# Altium schematic sheet [04] - PROCESSOR 1 of 3, JTAG HEADER.SchDoc
size A2; DocumentNumber: 4; SheetNumber: 4; SheetTotal: 13; NameAuthor: Angle Vu
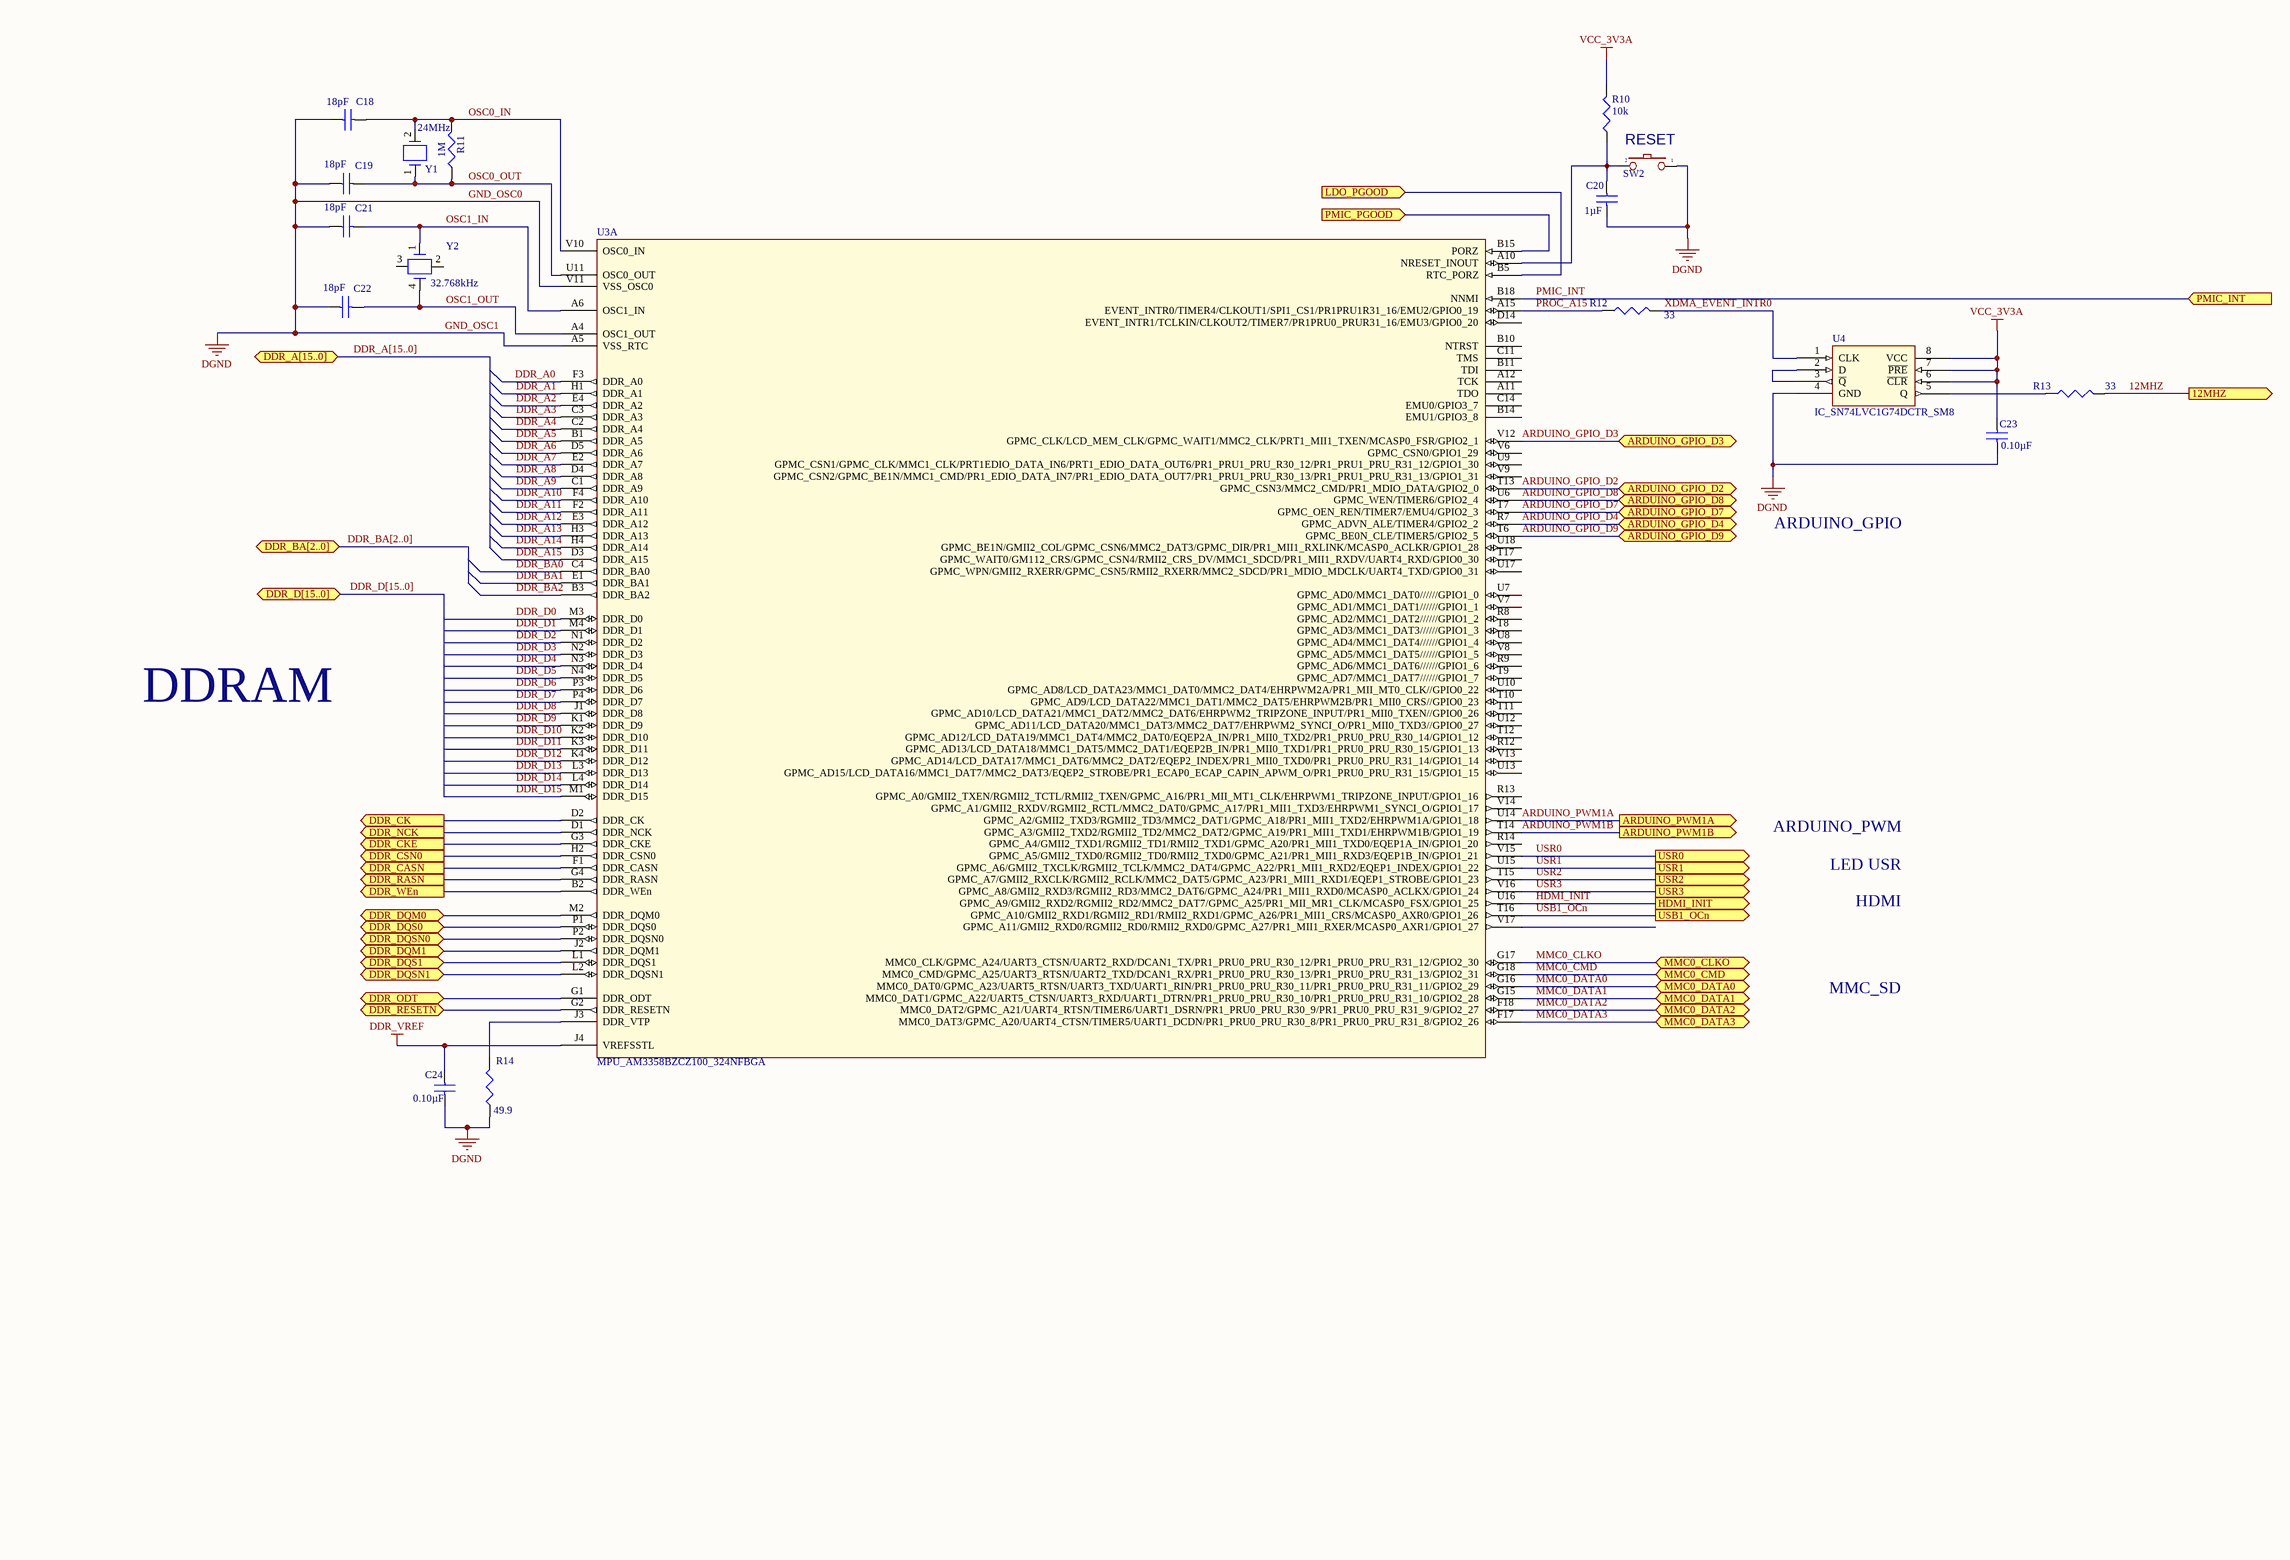
[diagram p0: [04] - PROCESSOR 1 of 3, JTAG HEADER.SchDoc]

## Parts
C18  Capacitance: 18pF  (hidden comment: C_CER_18pF_50V_C0G_0402_5%)
C19  Capacitance: 18pF  (hidden comment: C_CER_18pF_50V_C0G_0402_5%)
C20  Capacitance: 1µF  (hidden comment: C_CER_1uF_6.3V_X5R_0402_10%)
C21  Capacitance: 18pF  (hidden comment: C_CER_18pF_50V_C0G_0402_5%)
C22  Capacitance: 18pF  (hidden comment: C_CER_18pF_50V_C0G_0402_5%)
C23  Capacitance: 0.10µF  (hidden comment: C_CER_0.1uF_6.3V_X5R_0402_10%)
C24  Capacitance: 0.10µF  (hidden comment: C_CER_0.1uF_6.3V_X5R_0402_10%)
R10  Resistance (Ohms): 10k  (hidden comment: R_10K_1/16W_0402_1%)
R11  Resistance (Ohms): 1M  (hidden comment: R_1M_1/16W_0402_1%)
R12  Resistance (Ohms): 33  (hidden comment: R_33_1/16W_0402_5%)
R13  Resistance (Ohms): 33  (hidden comment: R_33_1/16W_0402_5%)
R14  Resistance (Ohms): 49.9  (hidden comment: R_49.9_1/16W_0402_1%)
SW2  SW2_DPST_SURFACE_5MM  [SW2-SMD]  (value not drawn)
U3  MPU_AM3358BZCZ100_324NFBGA  (part A of 3)
U4  IC_SN74LVC1G74DCTR_SM8
Y1  Frequency: 24MHz  (hidden comment: CRYTAL_24Mhz_7A-24.000MAAJ-T)
Y2  Frequency: 32.768kHz  (hidden comment: CRYSTAL_32.7680KhZ_CM200C32768AZFT)

## Ports
12MHZ (out), ARDUINO_GPIO_D2 (bidir), ARDUINO_GPIO_D3 (bidir), ARDUINO_GPIO_D4 (bidir), ARDUINO_GPIO_D7 (bidir), ARDUINO_GPIO_D8 (bidir), ARDUINO_GPIO_D9 (bidir), ARDUINO_PWM1A (out), ARDUINO_PWM1B (out), DDR_A[15..0] (bidir), DDR_BA[2..0] (bidir), DDR_CASN (out), DDR_CK (out), DDR_CKE (out), DDR_CSN0 (out), DDR_D[15..0] (bidir), DDR_DQM0 (bidir), DDR_DQM1 (bidir), DDR_DQS0 (bidir), DDR_DQS1 (bidir), DDR_DQSN0 (bidir), DDR_DQSN1 (bidir), DDR_NCK (out), DDR_ODT (bidir), DDR_RASN (out), DDR_RESETN (bidir), DDR_WEn (out), HDMI_INIT (out), LDO_PGOOD (in), MMC0_CLKO (bidir), MMC0_CMD (bidir), MMC0_DATA0 (bidir), MMC0_DATA1 (bidir), MMC0_DATA2 (bidir), MMC0_DATA3 (bidir), PMIC_INT (in), PMIC_PGOOD (in), USB1_OCn (out), USR0 (out), USR1 (out), USR2 (out), USR3 (out)

## Nets
DDR_VREF: C24.1 U3.J4(VREFSSTL)
GND_OSC0: C18.1 C19.1 C20.2 C21.1 C22.1 C23.2 C24.2 R14.1 SW2.1 U3.A5(VSS_RTC) U3.V11(VSS_OSC0) U4.4(GND)  [also labelled DGND, GND_OSC1]
VCC_3V3A: C23.1 R10.2 U4.6(~{CLR}) U4.7(~{PRE}) U4.8(VCC)
12MHZ: R13.2 ; port 12MHZ
ARDUINO_GPIO_D2: U3.T13(GPMC_CSN3/MMC2_CMD/PR1_MDIO_DATA/GPIO2_0) ; port ARDUINO_GPIO_D2
ARDUINO_GPIO_D3: U3.V12(GPMC_CLK/LCD_MEM_CLK/GPMC_WAIT1/MMC2_CLK/PRT1_MII1_TXEN/MCASP0_FSR/GPIO2_1) ; port ARDUINO_GPIO_D3
ARDUINO_GPIO_D4: U3.R7(GPMC_ADVN_ALE/TIMER4/GPIO2_2) ; port ARDUINO_GPIO_D4
ARDUINO_GPIO_D7: U3.T7(GPMC_OEN_REN/TIMER7/EMU4/GPIO2_3) ; port ARDUINO_GPIO_D7
ARDUINO_GPIO_D8: U3.U6(GPMC_WEN/TIMER6/GPIO2_4) ; port ARDUINO_GPIO_D8
ARDUINO_GPIO_D9: U3.T6(GPMC_BE0N_CLE/TIMER5/GPIO2_5) ; port ARDUINO_GPIO_D9
ARDUINO_PWM1A: U3.U14(GPMC_A2/GMII2_TXD3/RGMII2_TD3/MMC2_DAT1/GPMC_A18/PR1_MII1_TXD2/EHRPWM1A/GPIO1_18) ; port ARDUINO_PWM1A
ARDUINO_PWM1B: U3.T14(GPMC_A3/GMII2_TXD2/RGMII2_TD2/MMC2_DAT2/GPMC_A19/PR1_MII1_TXD1/EHRPWM1B/GPIO1_19) ; port ARDUINO_PWM1B
DDR_A0: U3.F3(DDR_A0)
DDR_A1: U3.H1(DDR_A1)
DDR_A2: U3.E4(DDR_A2)
DDR_A3: U3.C3(DDR_A3)
DDR_A4: U3.C2(DDR_A4)
DDR_A5: U3.B1(DDR_A5)
DDR_A6: U3.D5(DDR_A6)
DDR_A7: U3.E2(DDR_A7)
DDR_A8: U3.D4(DDR_A8)
DDR_A9: U3.C1(DDR_A9)
DDR_A10: U3.F4(DDR_A10)
DDR_A11: U3.F2(DDR_A11)
DDR_A12: U3.E3(DDR_A12)
DDR_A13: U3.H3(DDR_A13)
DDR_A14: U3.H4(DDR_A14)
DDR_A15: U3.D3(DDR_A15)
DDR_BA0: U3.C4(DDR_BA0)
DDR_BA1: U3.E1(DDR_BA1)
DDR_BA2: U3.B3(DDR_BA2)
DDR_CASN: U3.F1(DDR_CASN) ; port DDR_CASN
DDR_CK: U3.D2(DDR_CK) ; port DDR_CK
DDR_CKE: U3.G3(DDR_CKE) ; port DDR_CKE
DDR_CSN0: U3.H2(DDR_CSN0) ; port DDR_CSN0
DDR_D0: U3.M3(DDR_D0)
DDR_D1: U3.M4(DDR_D1)
DDR_D2: U3.N1(DDR_D2)
DDR_D3: U3.N2(DDR_D3)
DDR_D4: U3.N3(DDR_D4)
DDR_D5: U3.N4(DDR_D5)
DDR_D6: U3.P3(DDR_D6)
DDR_D7: U3.P4(DDR_D7)
DDR_D8: U3.J1(DDR_D8)
DDR_D9: U3.K1(DDR_D9)
DDR_D10: U3.K2(DDR_D10)
DDR_D11: U3.K3(DDR_D11)
DDR_D12: U3.K4(DDR_D12)
DDR_D13: U3.L3(DDR_D13)
DDR_D14: U3.L4(DDR_D14)
DDR_D15: U3.M1(DDR_D15)
DDR_DQM0: U3.M2(DDR_DQM0) ; port DDR_DQM0
DDR_DQM1: U3.J2(DDR_DQM1) ; port DDR_DQM1
DDR_DQS0: U3.P1(DDR_DQS0) ; port DDR_DQS0
DDR_DQS1: U3.L1(DDR_DQS1) ; port DDR_DQS1
DDR_DQSN0: U3.P2(DDR_DQSN0) ; port DDR_DQSN0
DDR_DQSN1: U3.L2(DDR_DQSN1) ; port DDR_DQSN1
DDR_NCK: U3.D1(DDR_NCK) ; port DDR_NCK
DDR_ODT: U3.G1(DDR_ODT) ; port DDR_ODT
DDR_RASN: U3.G4(DDR_RASN) ; port DDR_RASN
DDR_RESETN: U3.G2(DDR_RESETN) ; port DDR_RESETN
DDR_WEn: U3.B2(DDR_WEn) ; port DDR_WEn
HDMI_INIT: U3.U16(GPMC_A9/GMII2_RXD2/RGMII2_RD2/MMC2_DAT7/GPMC_A25/PR1_MII_MR1_CLK/MCASP0_FSX/GPIO1_25) ; port HDMI_INIT
LDO_PGOOD: U3.B5(RTC_PORZ) ; port LDO_PGOOD
MMC0_CLKO: U3.G17(MMC0_CLK/GPMC_A24/UART3_CTSN/UART2_RXD/DCAN1_TX/PR1_PRU0_PRU_R30_12/PR1_PRU0_PRU_R31_12/GPIO2_30) ; port MMC0_CLKO
MMC0_CMD: U3.G18(MMC0_CMD/GPMC_A25/UART3_RTSN/UART2_TXD/DCAN1_RX/PR1_PRU0_PRU_R30_13/PR1_PRU0_PRU_R31_13/GPIO2_31) ; port MMC0_CMD
MMC0_DATA0: U3.G16(MMC0_DAT0/GPMC_A23/UART5_RTSN/UART3_TXD/UART1_RIN/PR1_PRU0_PRU_R30_11/PR1_PRU0_PRU_R31_11/GPIO2_29) ; port MMC0_DATA0
MMC0_DATA1: U3.G15(MMC0_DAT1/GPMC_A22/UART5_CTSN/UART3_RXD/UART1_DTRN/PR1_PRU0_PRU_R30_10/PR1_PRU0_PRU_R31_10/GPIO2_28) ; port MMC0_DATA1
MMC0_DATA2: U3.F18(MMC0_DAT2/GPMC_A21/UART4_RTSN/TIMER6/UART1_DSRN/PR1_PRU0_PRU_R30_9/PR1_PRU0_PRU_R31_9/GPIO2_27) ; port MMC0_DATA2
MMC0_DATA3: U3.F17(MMC0_DAT3/GPMC_A20/UART4_CTSN/TIMER5/UART1_DCDN/PR1_PRU0_PRU_R30_8/PR1_PRU0_PRU_R31_8/GPIO2_26) ; port MMC0_DATA3
OSC0_IN: C18.2 R11.2 U3.V10(OSC0_IN) Y1.2
OSC0_OUT: C19.2 R11.1 U3.U11(OSC0_OUT) Y1.1
OSC1_IN: C21.2 U3.A6(OSC1_IN) Y2.1
OSC1_OUT: C22.2 U3.A4(OSC1_OUT) Y2.4
PMIC_INT: U3.B18(NNMI) ; port PMIC_INT
PMIC_PGOOD: U3.B15(PORZ) ; port PMIC_PGOOD
PROC_A15: R12.1 U3.A15(EVENT_INTR0/TIMER4/CLKOUT1/SPI1_CS1/PR1PRU1R31_16/EMU2/GPIO0_19)
USB1_OCn: U3.T16(GPMC_A10/GMII2_RXD1/RGMII2_RD1/RMII2_RXD1/GPMC_A26/PR1_MII1_CRS/MCASP0_AXR0/GPIO1_26) ; port USB1_OCn
USR0: U3.V15(GPMC_A5/GMII2_TXD0/RGMII2_TD0/RMII2_TXD0/GPMC_A21/PR1_MII1_RXD3/EQEP1B_IN/GPIO1_21) ; port USR0
USR1: U3.U15(GPMC_A6/GMII2_TXCLK/RGMII2_TCLK/MMC2_DAT4/GPMC_A22/PR1_MII1_RXD2/EQEP1_INDEX/GPIO1_22) ; port USR1
USR2: U3.T15(GPMC_A7/GMII2_RXCLK/RGMII2_RCLK/MMC2_DAT5/GPMC_A23/PR1_MII1_RXD1/EQEP1_STROBE/GPIO1_23) ; port USR2
USR3: U3.V16(GPMC_A8/GMII2_RXD3/RGMII2_RD3/MMC2_DAT6/GPMC_A24/PR1_MII1_RXD0/MCASP0_ACLKX/GPIO1_24) ; port USR3
XDMA_EVENT_INTR0: R12.2 U4.1(CLK)
NetC20_1: C20.1 R10.1 SW2.2 U3.A10(NRESET_INOUT)
NetR13_1: R13.1 U4.5(Q)
NetR14_2: R14.2 U3.J3(DDR_VTP)
NetU4_2: U4.2(D) U4.3(~{Q})

Not connected (* = marked no-connect by the designer): U3 A11(TDO) A12(TCK) B10(NTRST) B11(TDI) B14(EMU1/GPIO3_8) C11(TMS) C14(EMU0/GPIO3_7) D14(EVENT_INTR1/TCLKIN/CLKOUT2/TIMER7/PR1PRU0_PRUR31_16/EMU3/GPIO0_20) R8(GPMC_AD2/MMC1_DAT2//////GPIO1_2) R9(GPMC_AD6/MMC1_DAT6//////GPIO1_6) R12(GPMC_AD13/LCD_DATA18/MMC1_DAT5/MMC2_DAT1/EQEP2B_IN/PR1_MII0_TXD1/PR1_PRU0_PRU_R30_15/GPIO1_13) R13(GPMC_A0/GMII2_TXEN/RGMII2_TCTL/RMII2_TXEN/GPMC_A16/PR1_MII_MT1_CLK/EHRPWM1_TRIPZONE_INPUT/GPIO1_16) R14(GPMC_A4/GMII2_TXD1/RGMII2_TD1/RMII2_TXD1/GPMC_A20/PR1_MII1_TXD0/EQEP1A_IN/GPIO1_20) T8(GPMC_AD3/MMC1_DAT3//////GPIO1_3) T9(GPMC_AD7/MMC1_DAT7//////GPIO1_7) T10(GPMC_AD9/LCD_DATA22/MMC1_DAT1/MMC2_DAT5/EHRPWM2B/PR1_MII0_CRS//GPIO0_23) T11(GPMC_AD10/LCD_DATA21/MMC1_DAT2/MMC2_DAT6/EHRPWM2_TRIPZONE_INPUT/PR1_MII0_TXEN//GPIO0_26) T12(GPMC_AD12/LCD_DATA19/MMC1_DAT4/MMC2_DAT0/EQEP2A_IN/PR1_MII0_TXD2/PR1_PRU0_PRU_R30_14/GPIO1_12) T17(GPMC_WAIT0/GM112_CRS/GPMC_CSN4/RMII2_CRS_DV/MMC1_SDCD/PR1_MII1_RXDV/UART4_RXD/GPIO0_30) U7(GPMC_AD0/MMC1_DAT0//////GPIO1_0) U8(GPMC_AD4/MMC1_DAT4//////GPIO1_4) U9(GPMC_CSN1/GPMC_CLK/MMC1_CLK/PRT1EDIO_DATA_IN6/PRT1_EDIO_DATA_OUT6/PR1_PRU1_PRU_R30_12/PR1_PRU1_PRU_R31_12/GPIO1_30) U10(GPMC_AD8/LCD_DATA23/MMC1_DAT0/MMC2_DAT4/EHRPWM2A/PR1_MII_MT0_CLK//GPIO0_22) U12(GPMC_AD11/LCD_DATA20/MMC1_DAT3/MMC2_DAT7/EHRPWM2_SYNCI_O/PR1_MII0_TXD3//GPIO0_27) U13(GPMC_AD15/LCD_DATA16/MMC1_DAT7/MMC2_DAT3/EQEP2_STROBE/PR1_ECAP0_ECAP_CAPIN_APWM_O/PR1_PRU0_PRU_R31_15/GPIO1_15) U17(GPMC_WPN/GMII2_RXERR/GPMC_CSN5/RMII2_RXERR/MMC2_SDCD/PR1_MDIO_MDCLK/UART4_TXD/GPIO0_31) U18(GPMC_BE1N/GMII2_COL/GPMC_CSN6/MMC2_DAT3/GPMC_DIR/PR1_MII1_RXLINK/MCASP0_ACLKR/GPIO1_28) V6(GPMC_CSN0/GPIO1_29) V7(GPMC_AD1/MMC1_DAT1//////GPIO1_1) V8(GPMC_AD5/MMC1_DAT5//////GPIO1_5) V9(GPMC_CSN2/GPMC_BE1N/MMC1_CMD/PR1_EDIO_DATA_IN7/PR1_EDIO_DATA_OUT7/PR1_PRU1_PRU_R30_13/PR1_PRU1_PRU_R31_13/GPIO1_31) V13(GPMC_AD14/LCD_DATA17/MMC1_DAT6/MMC2_DAT2/EQEP2_INDEX/PR1_MII0_TXD0/PR1_PRU0_PRU_R31_14/GPIO1_14) V14(GPMC_A1/GMII2_RXDV/RGMII2_RCTL/MMC2_DAT0/GPMC_A17/PR1_MII1_TXD3/EHRPWM1_SYNCI_O/GPIO1_17) V17(GPMC_A11/GMII2_RXD0/RGMII2_RD0/RMII2_RXD0/GPMC_A27/PR1_MII1_RXER/MCASP0_AXR1/GPIO1_27); Y2 2 3

## Buses and harness runs
bus DDR_A[15..0] = port DDR_A[15..0]
bus DDR_BA[2..0] = port DDR_BA[2..0]
bus DDR_D[15..0] = port DDR_D[15..0]

## Notes on the sheet
- RESET
- ARDUINO_GPIO
- DDRAM
- ARDUINO_PWM
- LED USR
- HDMI
- MMC_SD
- CLOCKS (CPU & PCIE)
- Designed By
- Checked By
- Page Name:
- Size:
- A2
- Company:
- Address:
- Sheet:
- /

## Library data of the parts
C18 C19 C21 C22 = C_CER_18pF_50V_C0G_0402_5%: CAP CER 18PF 50V NP0 0402; Manufacturer: Murata Electronics North America; Manufacturer Part Number: GRM1555C1H180JZ01D; Tolerance: ±5%; Temperature Coefficient: C0G, NP0; Supplier 1: Digi-Key; RoHS: RoHS Compliant; Category: Capacitors; Stock 1: 0; Pricing 1: 10000=0 (USD); Packaging: Tape & Reel (TR); Part Status: Obsolete; Voltage - Rated: 50V; Operating Temperature: -55°C ~ 125°C; Features: -; Ratings: -; Applications: General Purpose; Failure Rate: *; Mounting Type: Surface Mount, MLCC; Package / Case: 0402 (1005 Metric); Size / Dimension: 0.039" L x 0.020" W (1.00mm x 0.50mm); Height - Seated (Max): -; Thickness (Max): 0.022" (0.55mm); Lead Spacing: -; Lead Style: -; ComponentLink1URL: http://media.digikey.com/pdf/Data%20Sheets/Murata%20PDFs/Chip%20Monolithic%20Ceramic%20Caps.pdf; ComponentLink1Description: http://media.digikey.com/pdf/Data%20Sheets/Murata%20PDFs/Chip%20Monolithic%20Ceramic%20Caps.pdf; Supplier Part Number 1: 490-1281-2-ND
C20 = C_CER_1uF_6.3V_X5R_0402_10%: CAP CER 1UF 6.3V X5R 0402; Manufacturer: Murata Electronics North America; Manufacturer Part Number: GRM155R60J105KE19D; Tolerance: ±10%; Supplier 1: Digi-Key; RoHS: RoHS Compliant; Category: Capacitors; Stock 1: 3360000; Pricing 1: 10000=0.00365, 20000=0.00348, 30000=0.00331, 50000=0.00296, 100000=0.00239 (USD); Packaging: Tape & Reel (TR); Part Status: Active; Voltage - Rated: 6.3V; Temperature Coefficient: X5R; Operating Temperature: -55°C ~ 85°C; Features: -; Ratings: -; Applications: General Purpose; Failure Rate: *; Mounting Type: Surface Mount, MLCC; Package / Case: 0402 (1005 Metric); Size / Dimension: 0.039" L x 0.020" W (1.00mm x 0.50mm); Height - Seated (Max): -; Thickness (Max): 0.022" (0.55mm); Lead Spacing: -; Lead Style: -; ComponentLink1URL: http://www.murata.com/~/media/webrenewal/support/library/catalog/products/capacitor/mlcc/c02e.pdf; ComponentLink1Description: http://www.murata.com/~/media/webrenewal/support/library/catalog/products/capacitor/mlcc/c02e.pdf; Supplier Part Number 1: 490-1320-2-ND
C23 C24 = C_CER_0.1uF_6.3V_X5R_0402_10%: CAP CER 0.1UF 6.3V X5R 0402; Manufacturer: Murata Electronics North America; Manufacturer Part Number: GRM155R60J104KA01D; Tolerance: ±10%; Supplier 1: Digi-Key; RoHS: RoHS Compliant; Category: Capacitors; Stock 1: 370000; Pricing 1: 10000=0.0021, 20000=0.002, 30000=0.0019, 50000=0.0017, 100000=0.00138 (USD); Packaging: Tape & Reel (TR); Part Status: Active; Voltage - Rated: 6.3V; Temperature Coefficient: X5R; Operating Temperature: -55°C ~ 85°C; Features: -; Ratings: -; Applications: General Purpose; Failure Rate: *; Mounting Type: Surface Mount, MLCC; Package / Case: 0402 (1005 Metric); Size / Dimension: 0.039" L x 0.020" W (1.00mm x 0.50mm); Height - Seated (Max): -; Thickness (Max): 0.022" (0.55mm); Lead Spacing: -; Lead Style: -; ComponentLink1URL: http://www.murata.com/~/media/webrenewal/support/library/catalog/products/capacitor/mlcc/c02e.pdf; ComponentLink1Description: http://www.murata.com/~/media/webrenewal/support/library/catalog/products/capacitor/mlcc/c02e.pdf; Supplier Part Number 1: 490-6287-2-ND
R10 = R_10K_1/16W_0402_1%: RES SMD 10K OHM 1% 1/16W 0402; Manufacturer: Yageo; Manufacturer Part Number: RC0402FR-0710KL; Power (Watts): 0.063W, 1/16W; Temperature Coefficient: ±100ppm/°C; Supplier 1: Digi-Key; RoHS: RoHS Compliant; Category: Resistors; Stock 1: 13060454; Pricing 1: 1=0.1, 10=0.013, 25=0.0096, 100=0.0054, 250=0.00412, 500=0.00328, 1000=0.00242, 2500=0.0021, 5000=0.00173 (USD); Packaging: Cut Tape (CT); Part Status: Active; Tolerance: ±1%; Composition: Thick Film; Features: Moisture Resistant; Operating Temperature: -55°C ~ 155°C; Package / Case: 0402 (1005 Metric); Supplier Device Package: 0402; Size / Dimension: 0.039" L x 0.020" W (1.00mm x 0.50mm); Height: 0.016" (0.40mm); Number of Terminations: 2; Failure Rate: -; ComponentLink1URL: http://www.yageo.com/documents/recent/PYu-RC_Group_51_RoHS_L_04.pdf; ComponentLink1Description: http://www.yageo.com/documents/recent/PYu-RC_Group_51_RoHS_L_04.pdf; Supplier Part Number 1: 311-10.0KLRCT-ND
R11 = R_1M_1/16W_0402_1%: RES SMD 1M OHM 1% 1/16W 0402; Manufacturer: Vishay Dale; Manufacturer Part Number: CRCW04021M00FKED; Power (Watts): 0.063W, 1/16W; Temperature Coefficient: ±100ppm/°C; Supplier 1: Digi-Key; RoHS: RoHS Compliant; Category: Resistors; Stock 1: 620000; Pricing 1: 10000=0.0033, 30000=0.0029, 50000=0.00266, 100000=0.00261 (USD); Packaging: Tape & Reel (TR); Part Status: Active; Tolerance: ±1%; Composition: Thick Film; Features: Automotive AEC-Q200; Operating Temperature: -55°C ~ 155°C; Package / Case: 0402 (1005 Metric); Supplier Device Package: 0402; Size / Dimension: 0.039" L x 0.020" W (1.00mm x 0.50mm); Height: 0.016" (0.40mm); Number of Terminations: 2; Failure Rate: -; ComponentLink1URL: http://www.vishay.com/docs/20035/dcrcwe3.pdf; ComponentLink1Description: http://www.vishay.com/docs/20035/dcrcwe3.pdf; Supplier Part Number 1: 541-1.00MLTR-ND
R12 R13 = R_33_1/16W_0402_5%: RES SMD 33 OHM 5% 1/16W 0402; Manufacturer: Yageo; Manufacturer Part Number: RC0402JR-0733RL; Power (Watts): 0.063W, 1/16W; Temperature Coefficient: ±100ppm/°C; Supplier 1: Digi-Key; RoHS: RoHS Compliant; Category: Resistors; Stock 1: 1941028; Pricing 1: 1=0.1, 10=0.012, 25=0.0084, 100=0.0047, 250=0.0036, 500=0.0029, 1000=0.00213, 2500=0.00185, 5000=0.00153 (USD); Packaging: Cut Tape (CT); Part Status: Active; Tolerance: ±5%; Composition: Thick Film; Features: Moisture Resistant; Operating Temperature: -55°C ~ 155°C; Package / Case: 0402 (1005 Metric); Supplier Device Package: 0402; Size / Dimension: 0.039" L x 0.020" W (1.00mm x 0.50mm); Height: 0.016" (0.40mm); Number of Terminations: 2; Failure Rate: -; ComponentLink1URL: http://www.yageo.com/documents/recent/PYu-RC_Group_51_RoHS_L_04.pdf; ComponentLink1Description: http://www.yageo.com/documents/recent/PYu-RC_Group_51_RoHS_L_04.pdf; Supplier Part Number 1: 311-33JRCT-ND
R14 = R_49.9_1/16W_0402_1%: RES SMD 49.9 OHM 1% 1/16W 0402; Manufacturer: Yageo; Manufacturer Part Number: RC0402FR-0749R9L; Power (Watts): 0.063W, 1/16W; Temperature Coefficient: ±100ppm/°C; Supplier 1: Digi-Key; RoHS: RoHS Compliant; Category: Resistors; Stock 1: 3649790; Pricing 1: 1=0.1, 10=0.013, 25=0.0096, 100=0.0054, 250=0.00412, 500=0.00328, 1000=0.00242, 2500=0.0021, 5000=0.00173 (USD); Packaging: Cut Tape (CT); Part Status: Active; Tolerance: ±1%; Composition: Thick Film; Features: Moisture Resistant; Operating Temperature: -55°C ~ 155°C; Package / Case: 0402 (1005 Metric); Supplier Device Package: 0402; Size / Dimension: 0.039" L x 0.020" W (1.00mm x 0.50mm); Height: 0.016" (0.40mm); Number of Terminations: 2; Failure Rate: -; ComponentLink1URL: http://www.yageo.com/documents/recent/PYu-RC_Group_51_RoHS_L_04.pdf; ComponentLink1Description: http://www.yageo.com/documents/recent/PYu-RC_Group_51_RoHS_L_04.pdf; Supplier Part Number 1: 311-49.9LRCT-ND
SW2 = SW2_DPST_SURFACE_5MM: SWITCH TACTILE SPST-NO 0.05A 12V; Manufacturer: Wurth Electronics Inc; Manufacturer Part Number: 434121050836; Switch Function: Off-Mom; Contact Rating @ Voltage: 0.05A @ 12VDC; Actuator Type: Rectangular Button; Actuator Height off PCB, from Pins: 5.00mm; Actuator Orientation: Top Actuated; Outline: 6.00mm x 3.50mm; Illumination: Non-Illuminated; Operating Force: 360gf; Actuator Material: Liquid Crystal Polymer (LCP); Switch Travel: 0.25mm; Mechanical Life: 50,000 Cycles; Supplier 1: Digi-Key; RoHS: RoHS Compliant; Category: Switches; Stock 1: 0; Pricing 1: 1500=0.27 (USD); Packaging: Tape & Reel (TR); Part Status: Active; Circuit: SPST-NO; Mounting Type: Surface Mount; Termination Style: SMD (SMT) Tab; Illumination Voltage (Nominal): -; Illumination Type, Color: -; Ingress Protection: -; Features: -; Operating Temperature: -40°C ~ 85°C; ComponentLink1URL: http://katalog.we-online.de/em/datasheet/434121050836.pdf; ComponentLink1Description: http://katalog.we-online.de/em/datasheet/434121050836.pdf; Supplier Part Number 1: 732-7049-2-ND
U3 = MPU_AM3358BZCZ100_324NFBGA: IC MPU SITARA 1.0GHZ 324NFBGA; Manufacturer: Texas Instruments; Core Processor: ARM® Cortex®-A8; Number of Cores/Bus Width: 1 Core, 32-Bit; Co-Processors/DSP: Multimedia; NEON™ SIMD; RAM Controllers: LPDDR, DDR2, DDR3, DDR3L; Graphics Acceleration: Yes; Display & Interface Controllers: LCD, Touchscreen; Ethernet: 10/100/1000 Mbps (2); USB: USB 2.0 + PHY (2); Voltage - I/O: 1.8V, 3.3V; Security Features: Cryptography, Random Number Generator; Additional Interfaces: CAN, I²C, McASP, McSPI, MMC/SD/SDIO, UART; Supplier 1: Digi-Key; Manufacturer Part Number: AM3358BZCZ100; RoHS: RoHS Compliant; Category: Integrated Circuits (ICs); Stock 1: 6211; Pricing 1: 1=19.56, 10=17.978, 100=15.1835, 500=13.50676, 1000=12.38895, 2500=11.9232, 5000=11.64375 (USD); Packaging: Tube; Part Status: Active; Speed: 1.0GHz; SATA: -; Operating Temperature: 0°C ~ 90°C (TJ); Package / Case: 324-LFBGA; Supplier Device Package: 324-NFBGA(15x15); ComponentLink1URL: http://www.ti.com/lit/ds/symlink/am3352.pdf; ComponentLink1Description: http://www.ti.com/lit/ds/symlink/am3352.pdf; Supplier Part Number 1: 296-35869-5-ND
U4 = IC_SN74LVC1G74DCTR_SM8: IC D-TYPE POS TRG SNGL SM8; Manufacturer: Texas Instruments; Function: Set(Preset) and Reset; Output Type: Differential; Number of Elements: 1; Frequency - Clock: 200MHz; Max Propagation Delay @ V, Max CL: 6.4ns @ 5V, 50pF; Trigger Type: Positive Edge; Current - Output High, Low: 32mA, 32mA; Voltage - Supply: 1.65 V ~ 5.5 V; Current - Quiescent: 10µA; Input Capacitance: 5pF; Supplier 1: Digi-Key; Manufacturer Part Number: SN74LVC1G74DCTR; RoHS: RoHS Compliant; Category: Integrated Circuits (ICs); Stock 1: 15000; Pricing 1: 3000=0.24795, 6000=0.23085, 15000=0.2223, 30000=0.21375 (USD); Packaging: Tape & Reel (TR); Part Status: Active; Type: D-Type; Number of Bits per Element: 1; Operating Temperature: -40°C ~ 125°C (TA); Mounting Type: Surface Mount; Package / Case: 8-LSSOP, 8-MSOP (0.110", 2.80mm Width); ComponentLink1URL: http://www.ti.com/lit/ds/symlink/sn74lvc1g74.pdf; ComponentLink1Description: http://www.ti.com/lit/ds/symlink/sn74lvc1g74.pdf; Supplier Part Number 1: 296-25553-2-ND
Y1 = CRYTAL_24Mhz_7A-24.000MAAJ-T: CRYSTAL 24.0000MHZ 18PF SMD; Manufacturer: TXC CORPORATION; Frequency Stability: ±30ppm; ESR (Equivalent Series Resistance): 50 Ohm; Operating Mode: Fundamental; Supplier 1: Digi-Key; Manufacturer Part Number: 7A-24.000MAAJ-T; RoHS: RoHS Compliant; Category: Crystals and Oscillators; Stock 1: 134000; Pricing 1: 1000=0.375, 3000=0.3625, 5000=0.35, 10000=0.3375 (USD); Packaging: Tape & Reel (TR); Part Status: Active; Type: MHz Crystal; Frequency Tolerance: ±30ppm; Load Capacitance: 18pF; Operating Temperature: -20°C ~ 70°C; Ratings: -; Mounting Type: Surface Mount; Package / Case: 2-SMD, No Lead (DFN, LCC); Size / Dimension: 0.197" L x 0.126" W (5.00mm x 3.20mm); Height: 0.053" (1.35mm); ComponentLink1URL: http://www.txccrystal.com/images/pdf/7a.pdf; ComponentLink1Description: http://www.txccrystal.com/images/pdf/7a.pdf; Supplier Part Number 1: 887-1090-2-ND
Y2 = CRYSTAL_32.7680KhZ_CM200C32768AZFT: CRYSTAL 32.7680KHZ 12.5PF SMD; Manufacturer: Citizen Finedevice Co Ltd; Frequency Tolerance: ±30ppm; ESR (Equivalent Series Resistance): 50 kOhm; Operating Mode: Fundamental; Supplier 1: Digi-Key; Manufacturer Part Number: CM200C32768AZFT; RoHS: RoHS Compliant; Category: Crystals and Oscillators; Stock 1: 21000; Pricing 1: 3000=0.3, 6000=0.29, 15000=0.28 (USD); Packaging: Tape & Reel (TR); Part Status: Active; Type: kHz Crystal (Tuning Fork); Frequency Stability: -; Load Capacitance: 12.5pF; Operating Temperature: -40°C ~ 85°C; Ratings: -; Mounting Type: Surface Mount; Package / Case: 4-SOJ, 5.50mm pitch; Size / Dimension: 0.311" L x 0.146" W (7.90mm x 3.70mm); Height: 0.098" (2.50mm); ComponentLink1URL: http://cfd.citizen.co.jp/english/prod-tech/product/pdf/datasheet_TF/CM200C_CM250C_E.pdf; ComponentLink1Description: http://cfd.citizen.co.jp/english/prod-tech/product/pdf/datasheet_TF/CM200C_CM250C_E.pdf; Supplier Part Number 1: 300-8738-2-ND